# Altium schematic sheet WIZ850io_SCH_V100.SchDoc (part 3 of 3)
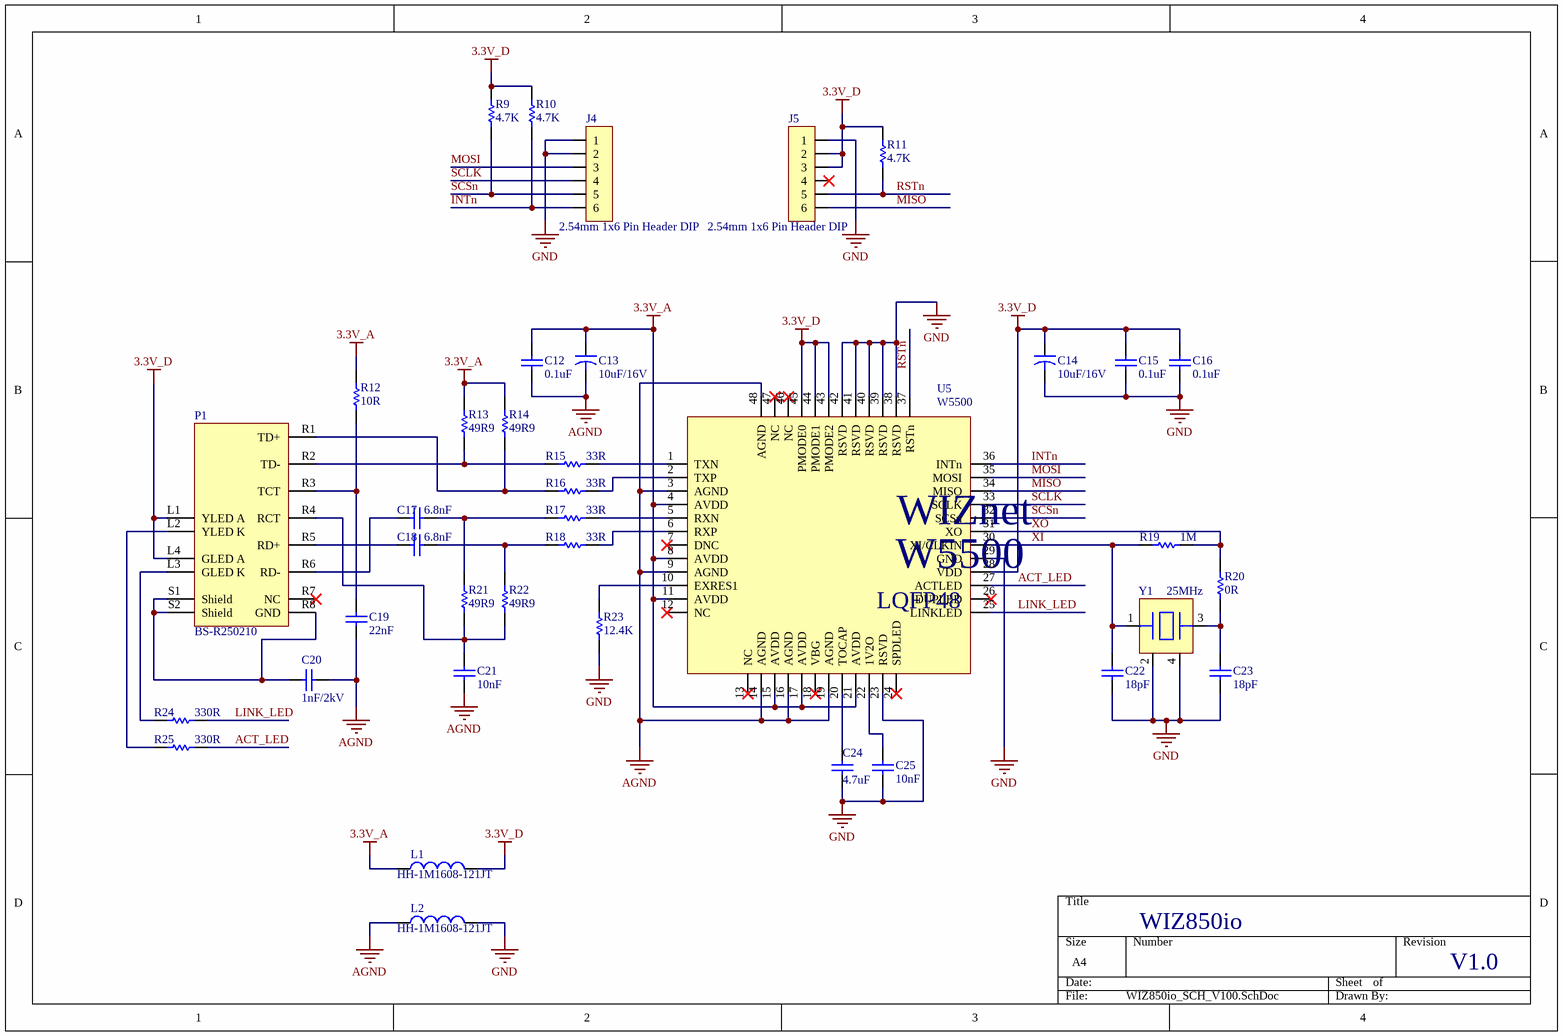
[diagram p2: WIZ850io_SCH_V100.SchDoc]

## Library data of the parts (continued)
R23 = RES-0402: Res Thick Film 0603 12.4K Ohm 1% 1/10W ±100ppm/°C Molded SMD SMD Paper T/R; Manufacturer: Vishay; Manufacturer Part Number: CRCW0603-12K4FKEA; Resistance: 12.4kR; Power Rating: 100mW; Voltage Rating: 75V; Supplier 1: Allied Electronics; Supplier Part Number 1: 70203341; RoHS: Yes; Category: Chip SMD Resistors; Mount: Surface Mount; Case/Package: 0603; Number of Pins: 2; Weight: 7.1E-05oz; Case Code (Imperial): 0603; Case Code (Metric): 1608; Contact Plating: Tin; Min Operating Temperature: -55°C; Max Operating Temperature: 155°C; Tolerance: 1%; Packaging: Tape and Reel; Temperature Coefficient: 100ppm/°C; Composition: Thick Film; Termination: SMD/SMT; Voltage Rating (DC): 75V; Package Quantity: 10; Number of Terminations: 2; Max Power Dissipation: 100mW; Military Standard: Not; Features: Automotive AEC-Q200; Length: 1.55mm; Height: 0.45mm; Width: 0.85mm; Depth: 0.85mm; Radiation Hardening: No; Lead Free: Lead Free; REACH SVHC: Unknown; ComponentLink1URL: https://datasheet.ciiva.com/11809/0900766b80d98afc-11809065.pdf?src-supplier=RSComponents; ComponentLink1Description: https://datasheet.ciiva.com/11809/0900766b80d98afc-11809065.pdf?src-supplier=RSComponents; ComponentLink2URL: https://datasheet.ciiva.com/16767/70201119-16767174.pdf?src-supplier=Allied+Electronics; ComponentLink2Description: https://datasheet.ciiva.com/16767/70201119-16767174.pdf?src-supplier=Allied+Electronics; ComponentLink3URL: https://datasheet.ciiva.com/5543/dcrcwe3-109170-5543127.pdf?src-supplier=Mouser; ComponentLink3Description: https://datasheet.ciiva.com/5543/dcrcwe3-109170-5543127.pdf?src-supplier=Mouser; ComponentLink4URL: https://datasheet.ciiva.com/16778/70201119-16778295.pdf?src-supplier=Allied+Electronics; ComponentLink4Description: https://datasheet.ciiva.com/16778/70201119-16778295.pdf?src-supplier=Allied+Electronics; ComponentLink5URL: https://datasheet.ciiva.com/3257/dcrcwe3-3257002.pdf?src-supplier=Avnet; ComponentLink5Description: https://datasheet.ciiva.com/3257/dcrcwe3-3257002.pdf?src-supplier=Avnet; ComponentLink6URL: https://datasheet.ciiva.com/16215/dcrcwe3-16215547.pdf?src-supplier=Future+Electronics; ComponentLink6Description: https://datasheet.ciiva.com/16215/dcrcwe3-16215547.pdf?src-supplier=Future+Electronics; ComponentLink7URL: https://datasheet.ciiva.com/16515/dcrcwe3-16515035.pdf?src-supplier=Avnet+Asia; ComponentLink7Description: https://datasheet.ciiva.com/16515/dcrcwe3-16515035.pdf?src-supplier=Avnet+Asia; ComponentLink8URL: https://datasheet.ciiva.com/2465/dcrcwe3-2465804.pdf?src-supplier=Digi-Key; ComponentLink8Description: https://datasheet.ciiva.com/2465/dcrcwe3-2465804.pdf?src-supplier=Digi-Key; ComponentLink9URL: https://datasheet.ciiva.com/2465/dcrcwe3-2465805.pdf?src-supplier=Digi-Key; ComponentLink9Description: https://datasheet.ciiva.com/2465/dcrcwe3-2465805.pdf?src-supplier=Digi-Key; ComponentLink10URL: https://datasheet.ciiva.com/2465/dcrcwe3-2465806.pdf?src-supplier=Digi-Key; ComponentLink10Description: https://datasheet.ciiva.com/2465/dcrcwe3-2465806.pdf?src-supplier=Digi-Key
R24 R25 = RES-0402: Res Thick Film 0603 330 Ohm 1% 0.1W(1/10W) +/-100ppm/ßC Pad SMD Automotive T/R; Manufacturer: Vishay Dale; Manufacturer Part Number: CRA06S043330RJTA; Circuit Type: Isolated; Number of Resistors: 2; Power Per Element: 62.5mW; Number of Contacts: 4; Voltage Rating (DC): 50V; Tolerance: 5%; Temperature Coefficient: 200ppm/°C; Power Rating: 100mW; Voltage Rating: 75V; Supplier 1: Avnet; Supplier Part Number 1: CRA06S043330RJTA; RoHS: Yes; Category: Resistor Arrays; Mount: Surface Mount; Case/Package: 0606; Number of Pins: 4; Case Code (Metric): 1615; Case Code (Imperial): 0605; Min Operating Temperature: -55°C; Max Operating Temperature: 155°C; Package Quantity: 5000; Resistance: 330R; Packaging: Tape and Reel; Length: 0.063inch; Height: 0.024inch; Thickness: 500um; Width: 0.059inch; Lead Free: Exempt; ComponentLink1URL: https://datasheet.ciiva.com/2697/cra06es-2697277.pdf?src-supplier=Digi-Key; ComponentLink1Description: https://datasheet.ciiva.com/2697/cra06es-2697277.pdf?src-supplier=Digi-Key; ComponentLink2URL: https://datasheet.ciiva.com/2697/cra06es-2697278.pdf?src-supplier=Digi-Key; ComponentLink2Description: https://datasheet.ciiva.com/2697/cra06es-2697278.pdf?src-supplier=Digi-Key; ComponentLink3URL: https://datasheet.ciiva.com/2697/cra06es-2697279.pdf?src-supplier=Digi-Key; ComponentLink3Description: https://datasheet.ciiva.com/2697/cra06es-2697279.pdf?src-supplier=Digi-Key; Supplier 2: Digi-Key; Supplier Part Number 2: 541-330HCT-ND; Stock 2: 1525; Pricing 2: 1=0.10000, 10=0.03400, 100=0.01390, 1000=0.00623, 2500=0.00540 (USD); Weight: 7.1E-05oz; Contact Plating: Tin; Composition: Thick Film; Number of Terminations: 2; Termination: SMD/SMT; Max Power Dissipation: 100mW; Military Standard: Not; Features: Automotive AEC-Q200; Depth: 0.85mm; Radiation Hardening: No; REACH SVHC: Unknown; ComponentLink4URL: https://datasheet.ciiva.com/11809/0900766b80d98afc-11809055.pdf?src-supplier=RSComponents; ComponentLink4Description: https://datasheet.ciiva.com/11809/0900766b80d98afc-11809055.pdf?src-supplier=RSComponents; ComponentLink5URL: https://datasheet.ciiva.com/2465/dcrcwe3-2465777.pdf?src-supplier=Digi-Key; ComponentLink5Description: https://datasheet.ciiva.com/2465/dcrcwe3-2465777.pdf?src-supplier=Digi-Key; ComponentLink6URL: https://datasheet.ciiva.com/2465/dcrcwe3-2465778.pdf?src-supplier=Digi-Key; ComponentLink6Description: https://datasheet.ciiva.com/2465/dcrcwe3-2465778.pdf?src-supplier=Digi-Key; ComponentLink7URL: https://datasheet.ciiva.com/2465/dcrcwe3-2465779.pdf?src-supplier=Digi-Key; ComponentLink7Description: https://datasheet.ciiva.com/2465/dcrcwe3-2465779.pdf?src-supplier=Digi-Key; ComponentLink8URL: https://datasheet.ciiva.com/5543/dcrcwe3-109170-5543013.pdf?src-supplier=Mouser; ComponentLink8Description: https://datasheet.ciiva.com/5543/dcrcwe3-109170-5543013.pdf?src-supplier=Mouser; ComponentLink9URL: https://datasheet.ciiva.com/16372/dcrcwe3-16372971.pdf?src-supplier=Future+Electronics; ComponentLink9Description: https://datasheet.ciiva.com/16372/dcrcwe3-16372971.pdf?src-supplier=Future+Electronics; ComponentLink10URL: https://datasheet.ciiva.com/16772/70201119-16772038.pdf?src-supplier=Allied+Electronics; ComponentLink10Description: https://datasheet.ciiva.com/16772/70201119-16772038.pdf?src-supplier=Allied+Electronics; ComponentLink11URL: https://datasheet.ciiva.com/26316/fld-crcw-e3-data-en-26316538.pdf?src-supplier=Distrelec; ComponentLink11Description: https://datasheet.ciiva.com/26316/fld-crcw-e3-data-en-26316538.pdf?src-supplier=Distrelec; ComponentLink12URL: https://datasheet.ciiva.com/15225/getdatasheetpartid-32830-15225339.pdf?src-supplier=Verical; ComponentLink12Description: https://datasheet.ciiva.com/15225/getdatasheetpartid-32830-15225339.pdf?src-supplier=Verical; ComponentLink13URL: https://datasheet.ciiva.com/16893/dcrcwe3-16893227.pdf?src-supplier=Avnet+Europe; ComponentLink13Description: https://datasheet.ciiva.com/16893/dcrcwe3-16893227.pdf?src-supplier=Avnet+Europe; ComponentLink14URL: https://datasheet.ciiva.com/7777/1697337-7777311.pdf?src-supplier=Element14; ComponentLink14Description: https://datasheet.ciiva.com/7777/1697337-7777311.pdf?src-supplier=Element14
U5 = W5500: Ethernet CTLR Single Chip 10Mbps/100Mbps 3.3V 48-Pin LQFP Reel; Manufacturer: WIZnet; Interface: SPI; Operating Supply Current: 132mA; Number of Transceivers: 1; Max Supply Voltage: 3.63V; Min Supply Voltage: 2.97V; Supplier 1: Digi-Key; Supplier Part Number 1: 1278-1021-ND; Manufacturer Part Number: W5500; RoHS: Yes; Category: Integrated Circuits (ICs); Stock 1: 895; Pricing 1: 1=3.95000, 10=3.54600, 25=3.35240, 100=2.75650, 250=2.47340, 500=2.38400, 1000=1.98170, 2500=1.90720, 5000=1.84760 (USD); Case/Package: LQFP; Number of Pins: 48; Min Operating Temperature: -40°C; Max Operating Temperature: 85°C; Package Quantity: 250; Packaging: Tray; Max Supply Current: 132mA; Lead Free: Lead Free; ComponentLink1URL: https://datasheet.ciiva.com/29644/w5500-ds-v100e-29644866.pdf?src-supplier=Digi-Key; ComponentLink1Description: https://datasheet.ciiva.com/29644/w5500-ds-v100e-29644866.pdf?src-supplier=Digi-Key; ComponentLink2URL: https://datasheet.ciiva.com/24199/w5500-24199988.pdf?src-supplier=Future+Electronics; ComponentLink2Description: https://datasheet.ciiva.com/24199/w5500-24199988.pdf?src-supplier=Future+Electronics
Y1 = OSC-82J0626-25MHz: X-tal 25MHz,3.2x2.5 SMD, CL=18pF